# EAGLE design M_B_adapter (EAGLE 9.6.2)
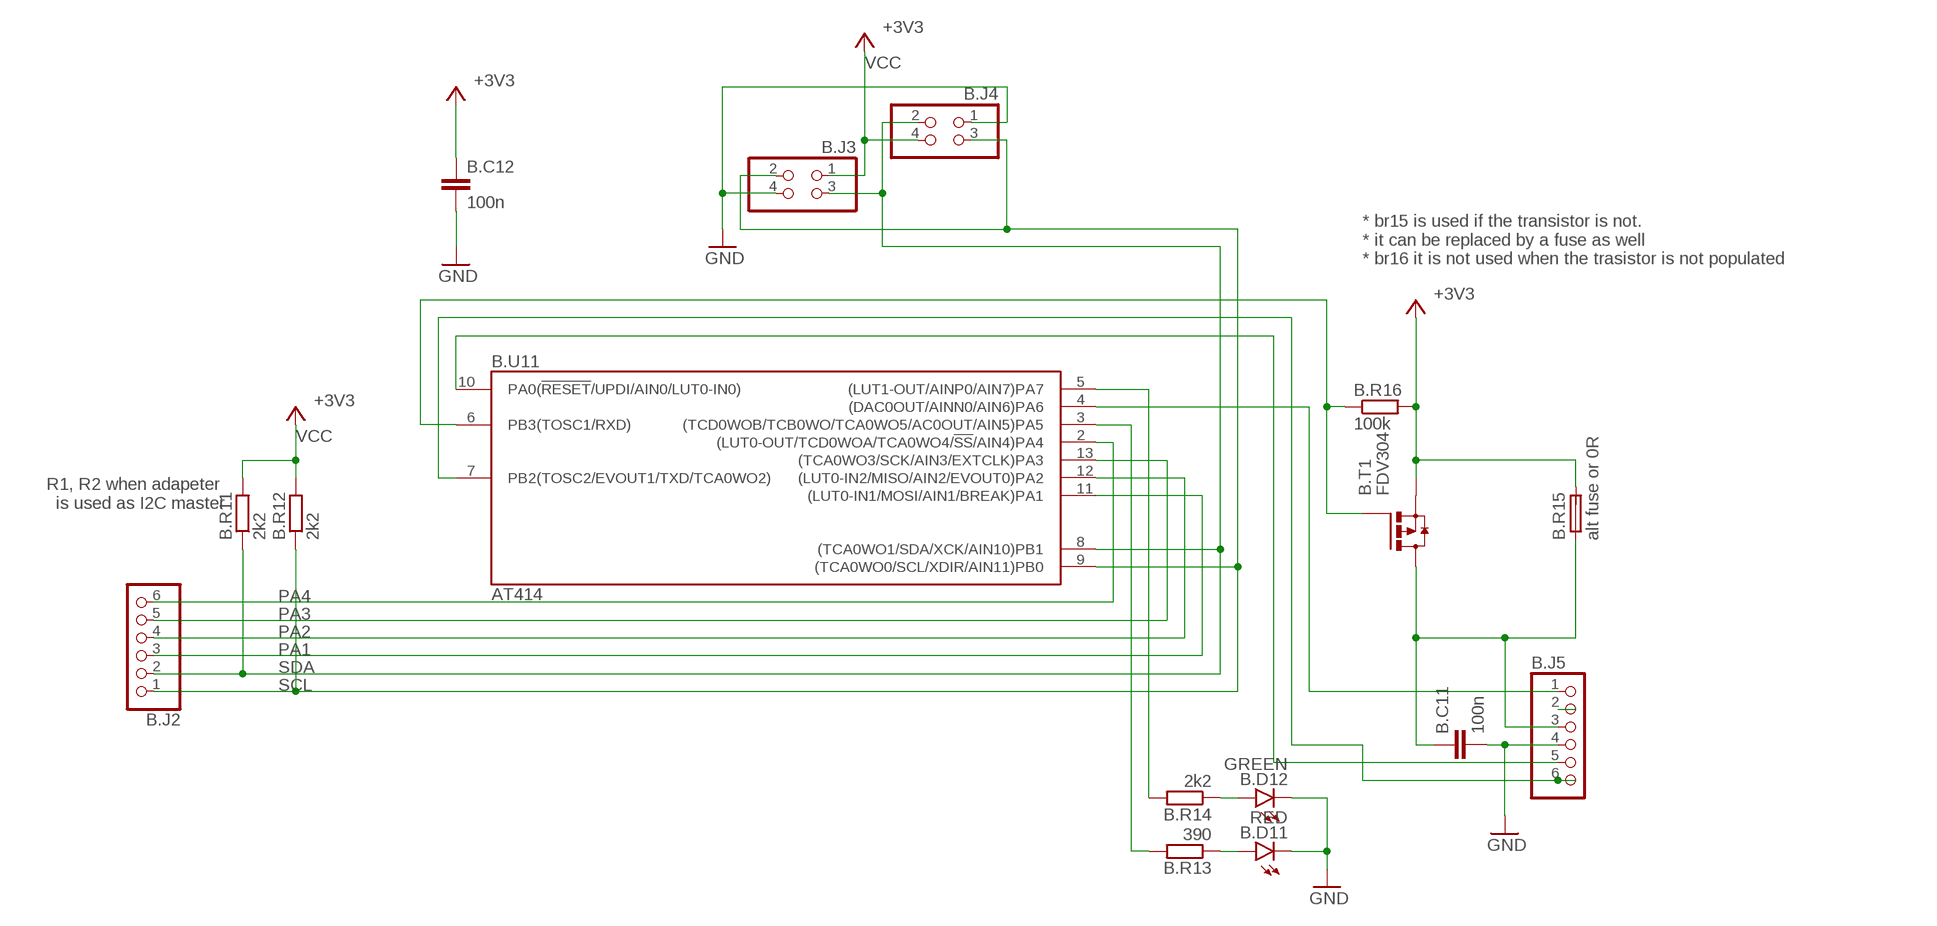
[diagram p0: schematic, sheet 1]

## Parts
B.C11  100n  C-EUC0603  [C0603]
B.C12  100n  C-EUC0603  [C0603]
B.D11  RED  LEDCHIP-LED0603  [CHIP-LED0603]
B.D12  GREEN  LEDCHIP-LED0603  [CHIP-LED0603]
B.J2  PINHD-1X6  [1X06]
B.J3  PINHD-2X2  [2X02]
B.J4  PINHD-2X2  [2X02]
B.J5  PINHD-1X6  [1X06]
B.R11  2k2  R-EU_R0603  [R0603]
B.R12  2k2  R-EU_R0603  [R0603]
B.R13  390  R-EU_R0603  [R0603]
B.R14  2k2  R-EU_R0603  [R0603]
B.R15  alt fuse or 0R  FUSE  [FUSE]
B.R16  100k  R-EU_R0603  [R0603]
B.T1  FDV304  P-MOSFET  [SO23]
B.U11  AT414  ATTINY414-SSN  [SO14]

## Nets
GND: B.C11.2 B.C12.2 B.D11.C1(C) B.D12.C1(C) B.J3.4 B.J4.1 B.J5.4
N$3: B.D12.A1(A) B.R14.1
N$4: B.C11.1 B.J5.3 B.R15.1 B.T1.D
N$5: B.R13.2 B.U11.3((TCD0WOB/TCB0WO/TCA0WO5/AC0OUT/AIN5)PA5)
PA1: B.J2.3 B.U11.11((LUT0-IN1/MOSI/AIN1/BREAK)PA1)
PA2: B.J2.4 B.U11.12((LUT0-IN2/MISO/AIN2/EVOUT0)PA2)
PA3: B.J2.5 B.U11.13((TCA0WO3/SCK/AIN3/EXTCLK)PA3)
PA4: B.J2.6 B.U11.2((LUT0-OUT/TCD0WOA/TCA0WO4/!SS!/AIN4)PA4)
PA6: B.J5.1 B.U11.4((DAC0OUT/AINN0/AIN6)PA6)
PA7: B.R14.2 B.U11.5((LUT1-OUT/AINP0/AIN7)PA7)
PA51: B.D11.A1(A) B.R13.1
PB2: B.J5.6 B.U11.7(PB2(TOSC2/EVOUT1/TXD/TCA0WO2))
PB3: B.R16.1 B.T1.G B.U11.6(PB3(TOSC1/RXD))
SCL: B.J2.1 B.J3.2 B.J4.3 B.R12.1 B.U11.9((TCA0WO0/SCL/XDIR/AIN11)PB0)
SDA: B.J2.2 B.J3.3 B.J4.2 B.R11.1 B.U11.8((TCA0WO1/SDA/XCK/AIN10)PB1)
UPDI: B.J5.5 B.U11.10(PA0(!RESET!/UPDI/AIN0/LUT0-IN0))
VBAT: B.J5.2
VCC: B.C12.1 B.J3.1 B.J4.4 B.R11.2 B.R12.2 B.R15.2 B.R16.2 B.T1.S ; supply symbol labelled +3V3

## Notes on the sheet
- * br15 is used if the transistor is not. 
  * it can be replaced by a fuse as well
  * br16 it is not used when the trasistor is not populated
- R1, R2 when adapeter 
  is used as I2C master

## Power pins joined to a net without a drawn wire
GND: B.U11.14(GND)
VCC: B.U11.1(VCC)

## Library data of the parts
B.C11 B.C12 = rcl:C-EU: CAPACITOR, European symbol; SPICEPREFIX: C
B.D11 B.D12 = led:LED: LED OSRAM: - CHIPLED LG R971, LG N971, LY N971, LG Q971, LY Q971, LO R971, LY R971 LH N974, LH R974 LS Q976, LO Q976, LY Q976 LO Q996 - Hyper CHIPLED LW Q18S LB Q993, LB Q99A, LB R99A - SideLED LS A670, LO A670, LY A670, LG A670, LP A670 LB A673, LV A673, LT A673, LW A673 LH A674 LY A675 LS A676, LA A676, LO A676, LY A676, LW A676 LS A679, LY A679, LG A679 - Hyper Micro SIDELED® LS Y876, LA Y876, LO Y876, LY Y876 LT Y87S - SmartLED LW L88C, LW L88S LB L89C, LB L89S, LG L890 LS L89K, LO L89K, LY L89K LS L896, LA L896, LO L896, LY L896 - TOPLED LS T670, LO T670, LY T670, LG T670, LP T670 LSG T670, LSP T670, LSY T670, LOP T670, LYG T670 LG T671, LOG T671, LSG T671 LB T673, LV T673, LT T673, LW T673 LH T674 LS T676, LA T676, LO T676, LY T676, LB T676, LH T676, LSB T676, LW T676 LB T67C, LV T67C, LT T67C, LS T67K, LO T67K, LY T67K, LW E67C LS E67B, LA E67B, LO E67B, LY E67B, LB E67C, LV E67C, LT E67C LW T67C LS T679, LY T679, LG T679 LS T770, LO T770, LY T770, LG T770, LP T770 LB T773, LV T773, LT T773, LW T773 LH T774 LS E675, LA E675, LY E675, LS T675 LS T776, LA T776, LO T776, LY T776, LB T776 LHGB T686 LT T68C, LB T68C - Hyper Mini TOPLED® LB M676 - Mini TOPLED Santana® LG M470 LS M47K, LO M47K, LY M47K Source: http://www.osram.convergy.de LUXEON: - LUMILED® LXK2-PW12-R00, LXK2-PW12-S00, LXK2-PW14-U00, LXK2-PW14-V00 LXK2-PM12-R00, LXK2-PM12-S00, LXK2-PM14-U00 LXK2-PE12-Q00, LXK2-PE12-R00, LXK2-PE12-S00, LXK2-PE14-T00, LXK2-PE14-U00 LXK2-PB12-K00, LXK2-PB12-L00, LXK2-PB12-M00, LXK2-PB14-N00, LXK2-PB14-P00, LXK2-PB14-Q00 LXK2-PR12-L00, LXK2-PR12-M00, LXK2-PR14-Q00, LXK2-PR14-R00 LXK2-PD12-Q00, LXK2-PD12-R00, LXK2-PD12-S00 LXK2-PH12-R00, LXK2-PH12-S00 LXK2-PL12-P00, LXK2-PL12-Q00, LXK2-PL12-R00 Source: www.luxeon.com KINGBRIGHT: KA-3528ASYC Source: www.kingbright.com
B.J2 B.J5 = pinhead2:PINHD-1X6: PIN HEADER
B.J3 B.J4 = pinhead2:PINHD-2X2: PIN HEADER
B.R11-B.R14 B.R16 = rcl:R-EU_: RESISTOR, European symbol; SPICEPREFIX: R
B.R15 = hugo:FUSE
B.T1 = hugo:P-MOSFET
B.U11 = atmel:ATTINY*14: 8-bit AVR tiny-1-series Microcontroller CPU: two-cycle hardware multiplier single pin Unified Program Debug Interface (UPDI) programmable watchdog timer with separate on-chip oscillator programmable brown-out detection circuit with software disable function internal calibrated oscillator Status aktiv aktiv aktiv aktiv ATtiny214 ATtiny414 ATtiny814 ATtiny1614 General purpose working registers 32 SRAM 128 B 256 B 512 B 2 kB Program flash memory 2 kB 4 kB 8 kB 16 kB EEPROM 64 B 128 B 128 B 256 B 16-bit Timer/Counter type A (TCA) 1 16-bit Timer/Counter type B (TCB) 1 2 12-bit Timer/Counter type D (TCD) 1 Real Time Counter (RTC) 1 USART 1 SPI 1 TWI (I2C) 1 ADC 1 2 ADC channels 10 10+4 ADC resolution 10 bit DAC 1 3 AC 1 3 Peripheral Touch Controller (PTC) - 1 PTC number of self-capacitance channels - 6 PTC number of mutual-capacitance channels - 9 Custom Configurable Logic/Lookup tables 1/2 Window Watchdog 1 Event System channels 6 General purpose I/O 12 External interrupts 12 CRCSCAN 1 Operating voltage 1.8 ... 5.5 V Speed grade 0 ... 5 MHz @ 1.8 ... 5.5 V 0 ... 10 MHz @ 2.7 ... 5.5 V 0 ... 20 MHz @ 4.5 ... 5.5 V Clock options internal 16/20 MHz low power RC oscillator internal 32.768 kHz ultra low power RC oscillator external 32.768 kHz low-frequency crystal oscillator external clock input Pin Name Other/Special ADC0 ADC1 PTC AC0 AC1 AC2 DAC0 USART0 SPI0 TWI0 TCA0 TCBn TCD0 CCL PA0 !RESET, UPDI AIN0 LUT0-IN0 PA1 AIN1 TxD MOSI SDA LUT0-IN1 PA2 EVOUT0 AIN2 RxD MISO SCL LUT0-IN2 PA3 EXTCLK AIN3 XCK SCK WO3 TCB1 WO PA4 AIN4 AIN0 X0/Y0 XDIR !SS WO4 WOA LUT0-OUT PA5 VREFA AIN5 AIN1 X1/Y1 OUT AINN0 WO5 TCB0 WO WOB PA6 AIN6 AIN2 X2/Y2 AINN0 AINP1 AINP0 OUT PA7 AIN7 AIN3 X3/Y3 AINP0 AINP0 AINN0 LUT1-OUT PB3 TOSC1 OUT RxD WO0 PB2 TOSC2, EVOUT1 OUT TxD WO2 PB1 AIN10 X4/Y4 AINP2 XCK SDA WO1 PB0 AIN11 X5/Y5 AINP2 AINP1 XDIR SCL WO0 only available in devices with 8/16KByte flash, X- or Y-line only available in device ATtiny1614

## Board
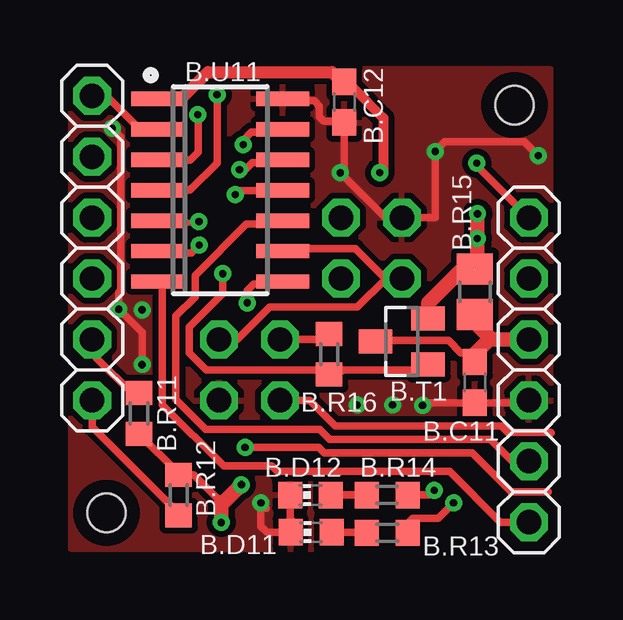
[diagram p1: board, top side]
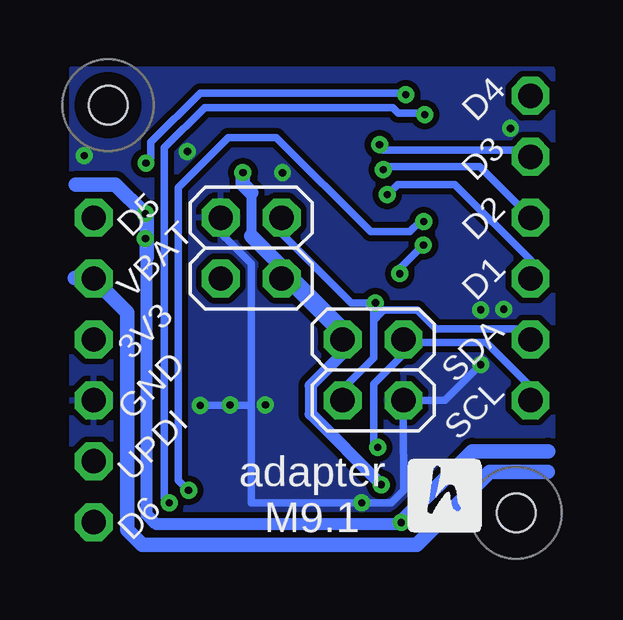
[diagram p2: board, bottom side, seen from below]

No outline drawn. Coordinates in mm, seen from the top.
Copper layers (1*16): Top 0.035mm / dielectric 1.5mm / Bottom 0.035mm
Design rules "default *": minimum track width 10mil, minimum drill 0.3mm, track to track 10mil, track to pad 10mil, pad to pad 10mil, via to via 10mil, smd to smd 10mil, copper to edge 15mil, drill to drill 10mil, minimum pad ring 10mil, minimum via ring 8mil, stop-mask expansion 4mil, vias tented up to drill 14mil, thermal gap 10mil
Holes 1.6 mm at 2,2 19,19
tRestrict: area 18,18 to 20,20; area 1,1 to 3,3
bRestrict: area 18,18 to 20,20; area 1,1 to 3,3

### Footprints (pad centres in the part's own frame; a part is rotated, then mirrored left to right if it is on the bottom)
C0603 = smd 1.1 x 1: 1 -0.85,0; 2 0.85,0
CHIP-LED0603 = smd 1.1 x 1: A1 0,-0.85; C1 0,0.85
1X06 = drill 1.016 pad 1.575 octagon: 1 -6.35,0; 2 -3.81,0; 3 -1.27,0; 4 1.27,0; 5 3.81,0; 6 6.35,0
2X02 = drill 1.016 pad 1.575 octagon: 1 -1.27,-1.27; 2 -1.27,1.27; 3 1.27,-1.27; 4 1.27,1.27
R0603 = smd 1 x 1.1: 1 -0.85,0; 2 0.85,0
FUSE = smd 1.3 x 1.5: 1 -0.95,0; 2 0.95,0
SO23 = smd 1 x 1.4: D 0,1.1; G -0.95,-1.1; S 0.95,-1.1
SO14 = smd 0.6 x 2.2: 1 -3.81,-2.6; 2 -2.54,-2.6; 3 -1.27,-2.6; 4 0,-2.6; 5 1.27,-2.6; 6 2.54,-2.6; 7 3.81,-2.6; 8 3.81,2.6; 9 2.54,2.6; 10 1.27,2.6; 11 0,2.6; 12 -1.27,2.6; 13 -2.54,2.6; 14 -3.81,2.6

### Placement (x,y rotation side)
B.C11  17.35,7.44 270 top
B.C12  11.91,19.13 270 top
B.D11  10.53,1.19 90 top
B.D12  10.5,2.74 90 top
B.J2  1.4,13.04 90 top
B.J3  7.96,7.96 270 bottom
B.J4  13.04,13.04 270 bottom
B.J5  19.6,7.96 270 top
B.R11  3.35,6.15 270 top
B.R12  5,2.74 90 top
B.R13  13.7,1.17 0 top
B.R14  13.69,2.74 0 top
B.R15  17.35,11.22 90 top
B.R16  11.28,8.61 90 top
B.T1  14.3,9.14 90 top
B.U11  6.74,15.45 270 top

### Tracks (layer width: path | path; a pad name or v marks a point on that pad's centre or on a via)
GND  (via drill 0.3)
  Top 0.305: 9.31,19.26 B.U11.14 9.39,19.19 10.65,19.19 10.87,18.97 10.87,18.52 11.06,18.33 11.51,18.33 | B.C12.2 11.91,16.36 v11.73,16.18 13.61,14.31 B.J4.1 15.7,14.31 v15.7,17.07 16.1,17.47 19.41,17.47 v19.99,16.89 | 9.65,1.77 B.D12.C1 9.6,2.74 | 9.65,1.77 9.65,1.19 8.69,1.19 8.43,1.45 v8.43,2.41 8.66,2.19 | B.D11.C1 9.68,1.39 9.65,1.42 9.68,1.42 9.68,1.77 9.65,1.77 | B.C11.2 17.56,6.38 | B.C11.2 15.28,6.59 v15.17,6.48 | v3.48,8.18 3.48,9.53 v2.52,10.49 2.52,11.2 2.59,11.28 2.59,17.68 v2.23,18.03 | B.J5.4 19.5,6.59 B.C11.2
  Top 0.406: 11.51,18.33 11.56,18.28 B.C12.2
  Bottom 0.305: B.J4.1 14.31,13.66 13.04,12.39 13.04,6.48 | 13.04,6.48 13.04,2.41 v8.43,2.41 7.21,2.41 6.68,2.94 6.7,5.94 6.69,5.95 B.J3.4 4.97,6.69 v3.48,8.18 | v15.17,6.48 13.04,6.48
  other vias: 3.48,10.46 12.45,6.5 13.92,6.5
  pour Bottom (isolate 0.254): 0.5,20.5 0.5,0.5 20.5,0.5 20.5,20.5
  pour Top (isolate 0.254): 0.5,20.5 0.5,0.5 20.5,0.5 20.5,20.5
N$3
  Top 0.305: B.R14.1 B.D12.A1
N$4
  Top 0.305: 13.24,9.19 16.25,9.19 16.76,8.67 16.97,8.67 B.C11.1
  Top 0.406: 13.24,9.19 B.T1.D
  Top 0.61: B.J5.3 18.05,9.23 | 18.05,9.23 17.96,9.23 17.35,8.62 B.C11.1 | 18.05,9.23 17.35,9.94 B.R15.1
N$5  (via drill 0.3)
  Top 0.305: v16.46,2.41 15.82,1.78 14.76,1.78 14.35,1.36 B.R13.2 | v5.8,18.6 5.82,18.58 5.82,17.04 5.49,16.7 4.16,16.7 B.U11.3
  Bottom 0.305: v16.46,2.41 16.66,2.62 16.66,17.22 14.98,18.9 7.15,18.9 6.92,18.68 5.88,18.68 v5.8,18.6
PA1  (via drill 0.3)
  Top 0.305: B.U11.11 9.29,15.43 7.48,15.43 v7.37,15.27
  Bottom 0.305: v7.37,15.27 6.93,15.7 4.56,15.7 1.4,12.54 B.J2.3
PA2  (via drill 0.3)
  Top 0.305: B.U11.12 9.21,16.6 8.07,16.6 7.78,16.31 v7.54,16.31
  Bottom 0.305: v7.54,16.31 7.41,16.43 3.52,16.43 B.J2.4
PA3  (via drill 0.3)
  Top 0.305: B.U11.13 9.21,17.87 8.03,17.87 7.69,17.53 v7.69,17.35
  Bottom 0.305: v7.69,17.35 7.69,17.27 7.55,17.13 1.68,17.13 B.J2.5
PA4
  Top 0.305: B.U11.2 4.12,18.02 3.35,18.02 1.98,19.39 B.J2.6
PA6  (via drill 0.3)
  Top 0.305: B.J5.1 17.42,16.49 v17.42,16.59 | v6.61,19.43 6.61,16.59 5.47,15.46 B.U11.4
  Bottom 0.305: v17.42,16.59 17.22,16.79 17.22,17.45 15.17,19.51 6.68,19.51 v6.61,19.43
PA7  (via drill 0.3)
  Top 0.254: B.U11.5 4.24,14.08 5.78,14.08 v5.85,14.15
  Top 0.305: v15.65,2.93 15.46,2.74 B.R14.2
  Bottom 0.305: v15.65,2.93 16.08,3.36 16.08,15.57 13.99,17.66 11.99,17.66 8.05,13.72 6.43,13.72 6,14.15 v5.85,14.15
PA51
  Top 0.305: B.R13.1 12.82,1.19 B.D11.A1
PB2
  Top 0.305: 5.05,11.64 B.U11.7 4.33,11.46 4.33,6.5 6.88,3.95 8.89,3.95 9.12,3.72 16.29,3.72 18.41,1.61 B.J5.6
PB3  (via drill 0.3)
  Top 0.305: v6.84,11.97 6.84,11.14 5.45,9.75 5.45,8.67 6.16,7.96 10.75,7.96 10.87,7.84 11.2,7.84 B.R16.1 11.63,7.76 11.84,7.96 15.17,7.96 B.T1.G | B.U11.6 4.22,12.83 5.53,12.83 v5.86,13.16
  Bottom 0.305: v6.84,11.97 6.84,12.18 v5.86,13.16
SCL  (via drill 0.3)
  Top 0.305: B.J3.2 7.44,9.23 8.79,10.58 12.46,10.58 13.65,11.77 B.J4.3 13.62,11.77 12.37,13.02 9.42,13.02 B.U11.9 | 5.03,1.89 B.R12.1 5,1.97 1.4,5.57 B.J2.1 | v7.77,4.73 10.85,4.73 11.07,4.51 17.23,4.51 18.87,2.87 20.4,2.87
  Bottom 0.305: B.J2.1 1.4,7.25 3.25,9.1 6.28,9.1 6.41,9.23 B.J3.2 6.69,8.62 7.93,7.38 7.93,4.85 7.81,4.73 v7.77,4.73 7.77,4.65
SDA  (via drill 0.3)
  Top 0.305: B.J2.2 1.58,9.05 1.58,8.47 3.05,7 B.R11.1 | 10.09,11.75 9.42,11.75 B.U11.8 9.24,11.54 8.14,11.54 7.86,11.27 v7.86,10.76 | B.J3.3 10.47,6.69 11.53,5.63 18.44,5.63 18.72,5.34 20.51,5.34 20.52,5.33
  Bottom 0.305: B.J2.2 1.83,9.66 5.34,9.66 6.13,10.45 7.51,10.45 | B.J3.3 9.23,7.17 7.93,8.47 7.93,10.03 | 11.77,14.29 B.J4.2 11.77,13.65 8.88,10.76 v7.86,10.76 | 7.93,10.03 7.63,10.33 | 7.63,10.33 7.63,10.53 v7.86,10.76 | v7.86,10.76 7.86,10.65 8.13,10.65 7.93,10.45 7.93,10.03 | v7.86,10.76 7.55,10.45 7.51,10.45 | 7.63,10.33 7.51,10.45
UPDI
  Top 0.305: B.U11.10 9.15,14.03 7.83,14.03 5.69,11.89 5.69,11.01 4.89,10.2 4.89,6.73 6.13,5.49 10.88,5.49 11.3,5.07 18,5.07 18.91,4.15 B.J5.5
VBAT
  Bottom 0.61: B.J5.2 | 0.69,3.71 3.1,3.71 6.15,0.66 17.58,0.66 18.21,1.29 18.21,10.36 19.6,11.75 B.J5.2 | B.J5.2 19.62,11.79 20.4,11.79
VCC  (via drill 0.3)  (1 unrouted)
  Top 0.305: 3.35,5.42 B.R11.2 5,3.65 B.R12.2 5.63,3.59 6.78,2.44 6.83,2.39 | 17.4,12.22 B.R15.2 | 9.94,9.23 B.J3.1 11.05,9.23 B.R16.2 | 6.78,1.87 v6.78,1.6
  Top 0.406: B.U11.1 5.11,19.27 | B.C12.1 12.17,19.72 12.28,19.72 13.54,18.47 13.54,16.34 v13.38,16.18
  Top 0.508: 5.11,19.27 6.22,20.38 11.38,20.38 11.79,19.98 B.C12.1 | v13.38,16.18 13.41,16.16
  Top 0.61: B.R15.2 17.45,12.17 v17.45,13.44 17.45,14.46 v17.46,14.47 | B.T1.S 15.4,10.75 16.86,12.22 17.34,12.22 | v7.62,3.17 6.83,2.39 | 6.78,2.44 v6.78,1.6
  Bottom 0.305: v6.78,1.6 6.78,1.52
  Bottom 0.406: 13.04,15.36 13.04,13.55
  Bottom 0.508: v13.38,16.18 13.38,16.11 | v7.62,3.17 10.57,6.12 10.57,7.31 9.23,8.65 B.J3.1 | v17.45,13.44 17.35,13.34 | v17.46,14.47 17.46,14.49 17.49,14.49 | 6.78,1.52 16.99,1.52 17.4,1.93 17.4,12.64 | v6.78,1.6 6.78,1.62
  Bottom 0.61: B.J4.4 11.74,11.79 11.74,12.26 13.04,13.55 | 17.4,12.64 17.4,14.47 v17.46,14.47 | 20.34,15.7 18.69,15.7 17.49,14.49 | v13.38,16.18 13.38,15.7 13.04,15.36 | 6.78,1.62 3.83,4.57 0.67,4.57
  Bottom 0.813: B.J4.4 11.44,11.77 9.23,9.56 B.J3.1

### Text on the board
bPlace: D4 | D3 | D2 | D1 | D5 | VBAT | SDA | SCL | 3V3 | GND | adapter / M9.1 | UPDI | D6
tDocu: ~ SS PA4 | ~ SCK PA3 | ^ RXD' MISO PA2 | PA6 ^ DAC | TXD' MOSI PA1 | VBAT | SDA | 3V3 | SCL | GND | UPDI | PB2 ^~